# Altium schematic sheet PCI Express_16765X11115_36PIN_Half length.schdoc: PCI Express x1 Top Sheet
size A4; SheetNumber: 1; SheetTotal: 2
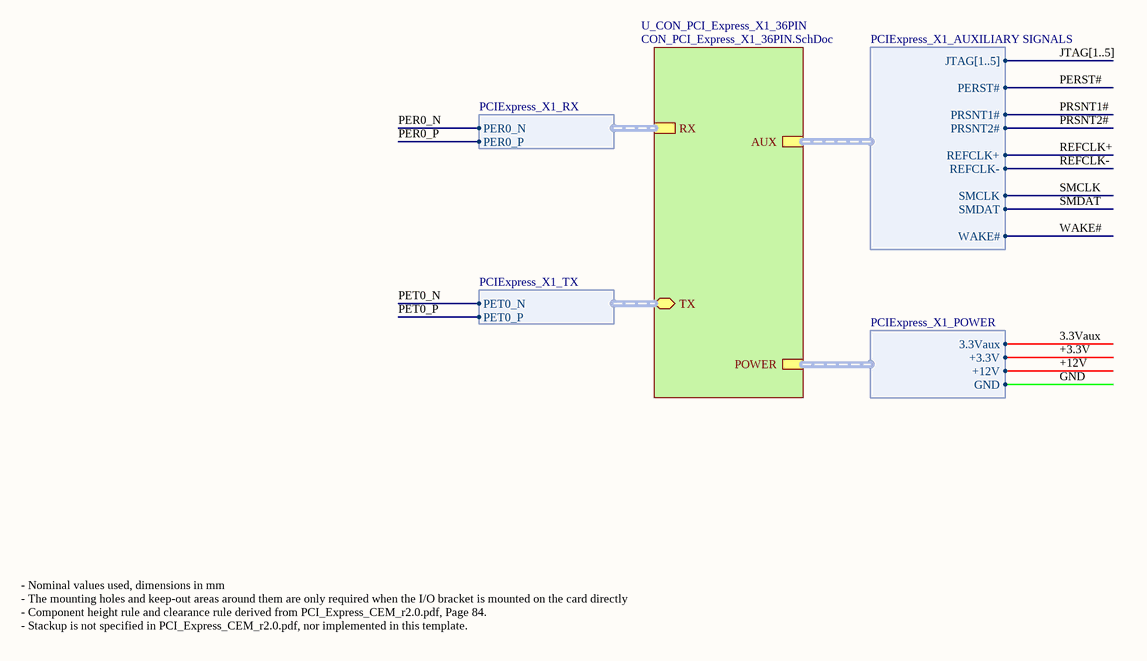
[diagram p0: PCI Express_16765X11115_36PIN_Half length.schdoc]

## Sub-sheets
U_CON_PCI_Express_X1_36PIN = CON_PCI_Express_X1_36PIN.SchDoc: POWER (harness PCIExpress_X1_POWER), AUX (harness PCIExpress_X1_AUXILIARY SIGNALS), RX (harness PCIExpress_X1_RX), TX (harness PCIExpress_X1_TX)

## Harnesses
PCIExpress_X1_RX: PER0_N, PER0_P
PCIExpress_X1_TX: PET0_N, PET0_P
PCIExpress_X1_POWER: +3.3V, +12V, GND, 3.3Vaux
PCIExpress_X1_AUXILIARY SIGNALS: JTAG[1..5], PERST#, PRSNT1#, PRSNT2#, REFCLK+, REFCLK-, SMCLK, SMDAT, WAKE#

## Nets
3.3Vaux: sheet U_CON_PCI_Express_X1_36PIN/POWER.3.3Vaux
+3.3V: sheet U_CON_PCI_Express_X1_36PIN/POWER.+3.3V
+12V: sheet U_CON_PCI_Express_X1_36PIN/POWER.+12V
GND: sheet U_CON_PCI_Express_X1_36PIN/POWER.GND
PER0_N: sheet U_CON_PCI_Express_X1_36PIN/RX.PER0_N
PER0_P: sheet U_CON_PCI_Express_X1_36PIN/RX.PER0_P
PERST#: sheet U_CON_PCI_Express_X1_36PIN/AUX.PERST#
PET0_N: sheet U_CON_PCI_Express_X1_36PIN/TX.PET0_N
PET0_P: sheet U_CON_PCI_Express_X1_36PIN/TX.PET0_P
PRSNT1#: sheet U_CON_PCI_Express_X1_36PIN/AUX.PRSNT1#
PRSNT2#: sheet U_CON_PCI_Express_X1_36PIN/AUX.PRSNT2#
REFCLK+: sheet U_CON_PCI_Express_X1_36PIN/AUX.REFCLK+
REFCLK-: sheet U_CON_PCI_Express_X1_36PIN/AUX.REFCLK-
SMCLK: sheet U_CON_PCI_Express_X1_36PIN/AUX.SMCLK
SMDAT: sheet U_CON_PCI_Express_X1_36PIN/AUX.SMDAT
WAKE#: sheet U_CON_PCI_Express_X1_36PIN/AUX.WAKE#

## Buses and harness runs
bus JTAG[1..5]

## Notes on the sheet
- - Nominal values used, dimensions in mm
  - The mounting holes and keep-out areas around them are only required when the I/O bracket is mounted on the card directly
  - Component height rule and clearance rule derived from PCI_Express_CEM_r2.0.pdf, Page 84.
  - Stackup is not specified in PCI_Express_CEM_r2.0.pdf, nor implemented in this template.
- Sheet Title
- Project Title
- Size:
- Date:
- A4
- Item:
- Time:
- Revision:
- Sheet
- of
- File: